# EAGLE schematic Bananna board (EAGLE 9.6.2)
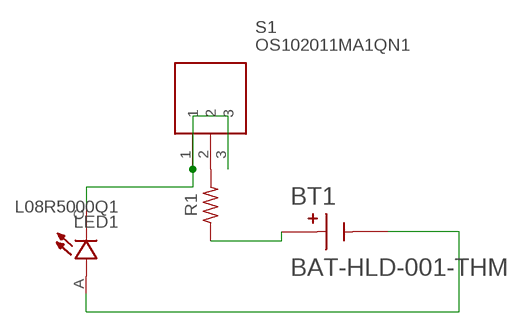
[diagram p0: schematic, sheet 1]

## Parts
BT1  BAT-HLD-001-THM  [BAT_BAT-HLD-001-THM]
LED1  L08R5000Q1  [LEDRD254W57D500H1070]
R1  R-US_0207/12  [0207/12]
S1  OS102011MA1QN1  [OS102011MA1QN1]

## Nets
N$1: R1.2 S1.2
N$2: LED1.C S1.1 S1.3
N$3: BT1.N LED1.A
N$4: BT1.P1(P) BT1.P2(P) BT1.P3(P) BT1.P4(P) R1.1

## Library data of the parts
BT1 = BAT-HLD-001-THM:BAT-HLD-001-THM; DESCRIPTION: Battery Retainer Coin, 20.0mm 1 Cell PC Pin; DIGI-KEY_PART_NUMBER: BAT-HLD-001-THM-ND; MF: Linx; MP: BAT-HLD-001-THM; PACKAGE: None; PURCHASE-URL: https://pricing.snapeda.com/search/part/BAT-HLD-001-THM/?ref=eda
LED1 = L08R5000Q1:L08R5000Q1: LED, Orange, Through Hole, T-1 3/4 (5mm), 30 mA, 2.1 V, 635 nm Check availability <https://pricing.snapeda.com/parts/L08R5000Q1/LED%20Technology/view-part?ref=eda>; AVAILABILITY: In Stock; DESCRIPTION: LED, 5MM, ORANGE; LED / Lamp Size: 5mm / T-1 3/4; LED Colour: Orange; Typ Luminous Intensity: 4.3mcd; Viewing Angle: ...; MF: LED Technology; MP: L08R5000Q1; PACKAGE: None; PRICE: None
R1 = resistor:R-US_: RESISTOR, American symbol
S1 = OS102011MA1QN1:OS102011MA1QN1: Switch Slide Right Angle SPDT 0.1A 12VDC Through Hole Slide Switch SPDT On-On 0.1 A@ 12 V dc Slide Source: Datasheet <http://www.ckswitches.com/media/1428/os.pdf>; DESCRIPTION: Switch Slide Right Angle SPDT 0.1A 12VDC Through Hole Slide Switch SPDT On-On 0.1 A@ 12 V dc Slide; HEIGHT: mm; MANUFACTURER_NAME: C & K COMPONENTS; MANUFACTURER_PART_NUMBER: OS102011MA1QN1; MOUSER_PART_NUMBER: 611-OS102011MA1QN1; MOUSER_PRICE-STOCK: https://www.mouser.co.uk/ProductDetail/CK/OS102011MA1QN1?qs=WtljUlYws5R6MUgHcLkz4w%3D%3D